# Altium schematic sheet 15.RS485.SchDoc: RS485
size A; SheetNumber: 15; SheetTotal: 16
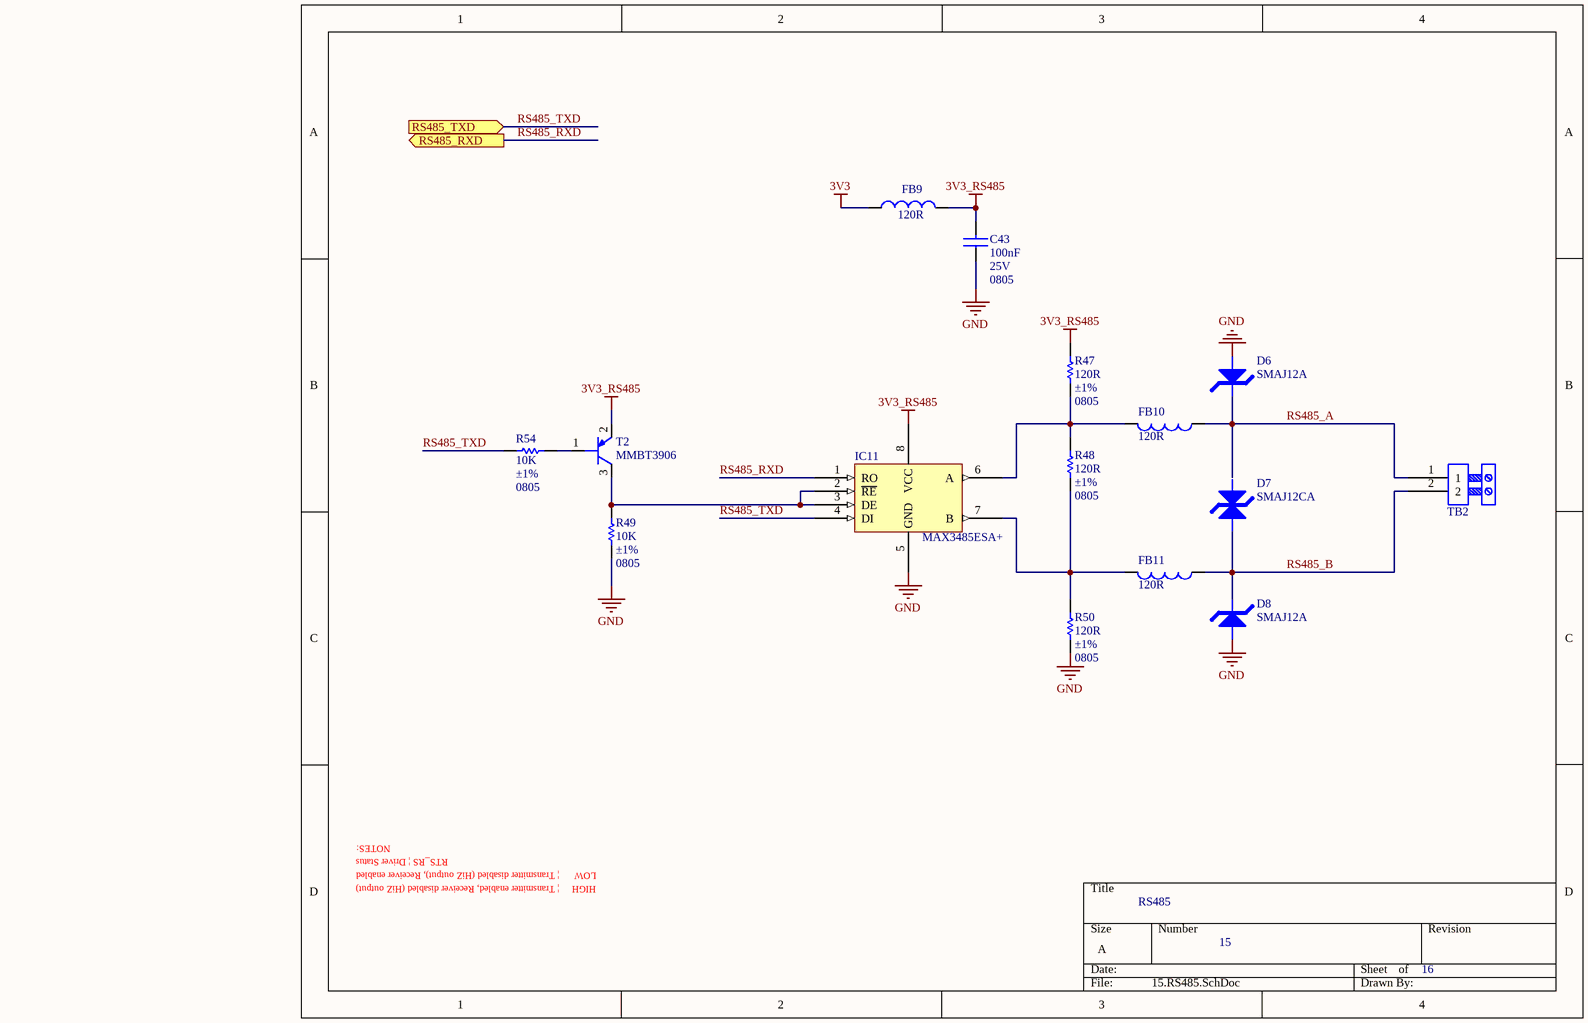
[diagram p0: 15.RS485.SchDoc]

## Parts
C43  Capacitance: 100nF  Voltage - Rated: 25V  Package / Case: 0805  [CAPC2012X100N_EIA0805]  (hidden comment: CAP_NP)
D6  value SMAJ12A  [DIOM5126X26N_DO-214AC_SMA]  (hidden comment: DIODE_TVS_UNI)
D7  value SMAJ12CA  [DIOM5126X26N_DO-214AC_SMA]  (hidden comment: DIODE_TVS_BI)
D8  value SMAJ12A  [DIOM5126X26N_DO-214AC_SMA]  (hidden comment: DIODE_TVS_UNI)
FB9  Impedance: 120R  [FILC2012X100N_EIA0805]  (hidden comment: BEAD)
FB10  Impedance: 120R  [FILC2012X100N_EIA0805]  (hidden comment: BEAD)
FB11  Impedance: 120R  [FILC2012X100N_EIA0805]  (hidden comment: BEAD)
IC11  Manufacturer Part Number: MAX3485ESA+  [SOIC127P600X175-8N]  (hidden comment: MAX3485)
R47  value 120R  Tolerance: ±1%  Package / Case: 0805  [RESC2013X65N_EIA0805]  (hidden comment: RES)
R48  value 120R  Tolerance: ±1%  Package / Case: 0805  [RESC2013X65N_EIA0805]  (hidden comment: RES)
R49  value 10K  Tolerance: ±1%  Package / Case: 0805  [RESC2013X65N_EIA0805]  (hidden comment: RES)
R50  value 120R  Tolerance: ±1%  Package / Case: 0805  [RESC2013X65N_EIA0805]  (hidden comment: RES)
R54  value 10K  Tolerance: ±1%  Package / Case: 0805  [RESC2013X65N_EIA0805]  (hidden comment: RES)
T2  MMBT3906  [SOT95P240X120-3N_SOT-23-3]
TB2  TB2_EURO  [TB2_EURO]  (value not drawn)

## Ports
RS485_RXD (out), RS485_TXD (in)

## Nets
3V3: FB9.1
3V3_RS485: C43.2 FB9.2 IC11.8(VCC) R47.1 T2.2(E)
GND: C43.1 D6.2 D8.2 IC11.5(GND) R49.2 R50.2
RS485_A: D6.1 D7.1 FB10.1 TB2.1
RS485_B: D7.2 D8.1 FB11.1 TB2.2
RS485_RXD: IC11.1(RO) ; port RS485_RXD
RS485_TXD: IC11.4(DI) R54.1 ; port RS485_TXD
NetFB10_2: FB10.2 IC11.6(A) R47.2 R48.1
NetFB11_2: FB11.2 IC11.7(B) R48.2 R50.1
NetIC11_2: IC11.2(~{RE}) IC11.3(DE) R49.1 T2.3(C)
NetR54_2: R54.2 T2.1(B)

## Notes on the sheet
- NOTES:
- RTS_RS | Driver Status
- LOW      | Transmitter disabled (HiZ output), Receiver enabled
- HIGH     | Transmitter enabled, Receiver disabled (HiZ output)

## Library data of the parts
C43 = SCAP00300093: CAP CER 0.1UF 25V X7R 0805; Manufacturer: Samsung Electro-Mechanics America, Inc.; Manufacturer Part Number: CL21B104KACNNNC; Value: 100nF; Tolerance: ±10%; Type: Multi Layer Ceramic Capacitor  (MLCC); Cost x1 ($): 0.10000; Cost x10 ($): 0.03300; Cost x100 ($): 0.01470; Cost x1000 ($): 0.00825; Distrubutor: Digikey; Lead Time: 11 Weeks; Part Number: SCAP00300093; Temperature Coefficient: X7R; Operating Temperature: -55°C ~ 125°C; Mounting Type: Surface Mount, MLCC; Size / Dimension: 0.079" L x 0.049" W (2.00mm x 1.25mm); Category: Capacitors; Family: Ceramic Capacitors; Distributor Part Number: 1276-1099-1-ND; Distributor Link: http://www.digikey.com/product-detail/en/samsung-electro-mechanics-america-inc/CL21B104KACNNNC/1276-1099-1-ND/3889185; ROHS: YES; Moisture Sensitivity Level (MSL): 1 (Unlimited); Quantity: 50
D6 D8 = SCP00005: TVS DIODE 12VWM 19.9VC SMA; Manufacturer: Littelfuse Inc.; Voltage - Reverse Standoff (Typ): 12V; Voltage - Breakdown (Min): 13.3V; Type: Zener; Cost x10 ($): 0.36000; Cost x100 ($): 0.27010; Cost x1000 ($): 0.15295; Distrubutor: Digikey; Lead Time: 10 Weeks; Cost x1 ($): 0.43000; Part Number: SCP00005; Category: Circuit Protection; Family: TVS - Diodes; Package / Case: DO-214AC, SMA; Manufacturer Part Number: SMAJ12A; Distributor Part Number: SMAJ12ALFCT-ND; ROHS: YES; Datasheet Link: http://www.digikey.com/product-detail/en/littelfuse-inc/SMAJ12A/SMAJ12ALFCT-ND/762482; Moisture Sensitivity Level (MSL): 1 (Unlimited); Quantity: 0; Part Status: Active
D7 = SCP00006: TVS DIODE 12VWM 19.9VC SMA; Manufacturer: Littelfuse Inc.; Voltage - Reverse Standoff (Typ): 12V; Voltage - Breakdown (Min): 13.3V; Type: Zener; Cost x10 ($): 0.39900; Cost x100 ($): 0.29940; Cost x1000 ($): 0.16958; Distrubutor: Digikey; Lead Time: 9 Weeks; Cost x1 ($): 0.47000; Part Number: SCP00006; Category: Circuit Protection; Family: TVS - Diodes; Package / Case: DO-214AC, SMA; Manufacturer Part Number: SMAJ12CA; Distributor Part Number: SMAJ12CALFCT-ND; ROHS: YES; Datasheet Link: http://www.digikey.com/product-detail/en/littelfuse-inc/SMAJ12CA/SMAJ12CALFCT-ND/762483; Moisture Sensitivity Level (MSL): 1 (Unlimited); Quantity: 0; Part Status: Active
FB9-FB11 = SFIL00005: FERRITE CHIP POWER 120 OHM SMD; Manufacturer: Laird-Signal Integrity Products; Manufacturer Part Number: HI0805O121R-10; Type: Differential Mode - Single; Current Rating: 3.5A; DC Resistance (DCR): 20 mOhm Max; Cost x10 ($): 0.08700; Cost x100 ($): 0.05230; Cost x1000 ($): 0.03010; Distrubutor: Digikey; Cost x1 ($): 0.10000; Part Number: SFIL00005; Package / Case: 0805 (2012 Metric); Value: BEAD; Category: Filters; Family: Ferrite Beads and Chips; Distributor Part Number: 240-2393-1-ND; ROHS: YES; Datasheet Link: http://www.digikey.com/product-detail/en/HI0805O121R-10/240-2393-1-ND/806753; Quantity: 50
IC11 = SIC00035: IC TXRX RS485/422 10MBPS 8SOIC; Manufacturer: Maxim Integrated; Vin: 3 V ~ 3.6 V; Protocol: RS422, RS485; Cost x10 ($): 3.24900; Cost x100 ($): 2.93260; Distrubutor: Digikey; Lead Time: 6 Weeks; Cost x1 ($): 3.42000; Part Number: SIC00035; Value: MAX3485; Speed: 10Mbps; Operating Temperature: -40°C ~ 85°C; Category: Integrated Circuits (ICs); Family: Interface - Drivers, Receivers, Transceivers; Package / Case: 8-SOIC (0.154", 3.90mm Width); Type: Transceiver; Cost x1000 ($): 2.93260; Distributor Part Number: MAX3485ESA+-ND; ROHS: YES; Distributor Link: http://www.digikey.com/product-detail/en/maxim-integrated/MAX3485ESA-/MAX3485ESA--ND/1702240; MSL: 1 (Unlimited); Quantity: 10
R47 R48 R50 = SRES03010052: RES SMD 120 OHM 1% 1/8W 0805; Manufacturer: Yageo; Manufacturer Part Number: RC0805FR-07120RL; Resistance (Ohm): 120; Power (Watts): 0.125W, 1/8W; Cost x1 ($): 0.10; Cost x10 ($): 0.21; Cost x100 ($): 0.84; Cost x1000 ($): 3.79; Distrubutor: Digikey; Part Number: SRES03010052; Category: Resistors; Family: Chip Resistor - Surface Mount; Distributor Part Number: 311-120CRCT-ND; Distributor Link: http://www.digikey.com/product-detail/en/RC0805FR-07120RL/311-120CRCT-ND/730522; ROHS: YES; Quantity: 0
R49 R54 = SRES03010098: RES SMD 10K OHM 1% 1/8W 0805; Manufacturer: Yageo; Manufacturer Part Number: RC0805FR-0710KL; Power (Watts): 0.125W, 1/8W; Cost x1 ($): 0.10; Cost x10 ($): 0.21; Cost x100 ($): 0.84; Cost x1000 ($): 3.79; Distrubutor: Digikey; Part Number: SRES03010098; Resistance (Ohm): 10K; Category: Resistors; Family: Chip Resistor - Surface Mount; Distributor Part Number: 311-10.0KCRCT-ND; Distributor Link: http://www.digikey.com/product-detail/en/RC0805FR-0710KL/311-10.0KCRCT-ND/730482; ROHS: YES; Quantity: 0
T2 = SSEM00023: TRANS PNP 40V 0.2A SOT-23; Manufacturer: Fairchild Semiconductor; Cost x10 ($): 0.18700; Cost x100 ($): 0.10170; Cost x1000 ($): 0.04264; Distrubutor: Digikey; Lead Time: 6 Weeks; Cost x1 ($): 0.20000; Part Number: SSEM00023; Value: MMBT3906; Category: Discrete Semiconductor Products; Family: Transistors - Bipolar (BJT) - Single; Package / Case: TO-236-3, SC-59, SOT-23-3; Type: PNP; Manufacturer Part Number: MMBT3906; Distributor Part Number: MMBT3906FSCT-ND; ROHS: YES; Datasheet Link: http://www.digikey.com/product-detail/en/MMBT3906/MMBT3906FSCT-ND/458972; Moisture Sensitivity Level (MSL): 1 (Unlimited); Part Status: Active; Quantity: 100
TB2 = SCON00138: TERM BLOCK HDR 2POS VERT 3.81MM; Manufacturer: On Shore Technology Inc.; Manufacturer Part Number: EDSTLZ1550/2; Value: TB2-HDR; Pitch: 0.150" (3.81mm); Connector Type: Header, Male Pins, Shrouded (4 Side); Cost x1 ($): 0.76000; Cost x10 ($): 0.67100; Cost x100 ($): 0.57860; Cost x1000 ($): 0.42080; Distrubutor: Digikey; Lead Time: 8 Weeks; Part Number: SCON00138; Category: Connectors, Interconnects; Family: Terminal Blocks - Headers, Plugs and Sockets; Mounting Type: Through Hole; Distributor Part Number: ED1934-ND; Datasheet Link: http://www.digikey.com/product-detail/en/on-shore-technology-inc/EDSTLZ1550-2/ED1934-ND/250541; ROHS: YES; Moisture Sensitivity Level (MSL): 1 (Unlimited); Part Status: Active; Quantity: 0